# EAGLE design airwatch (EAGLE 9.2.2)
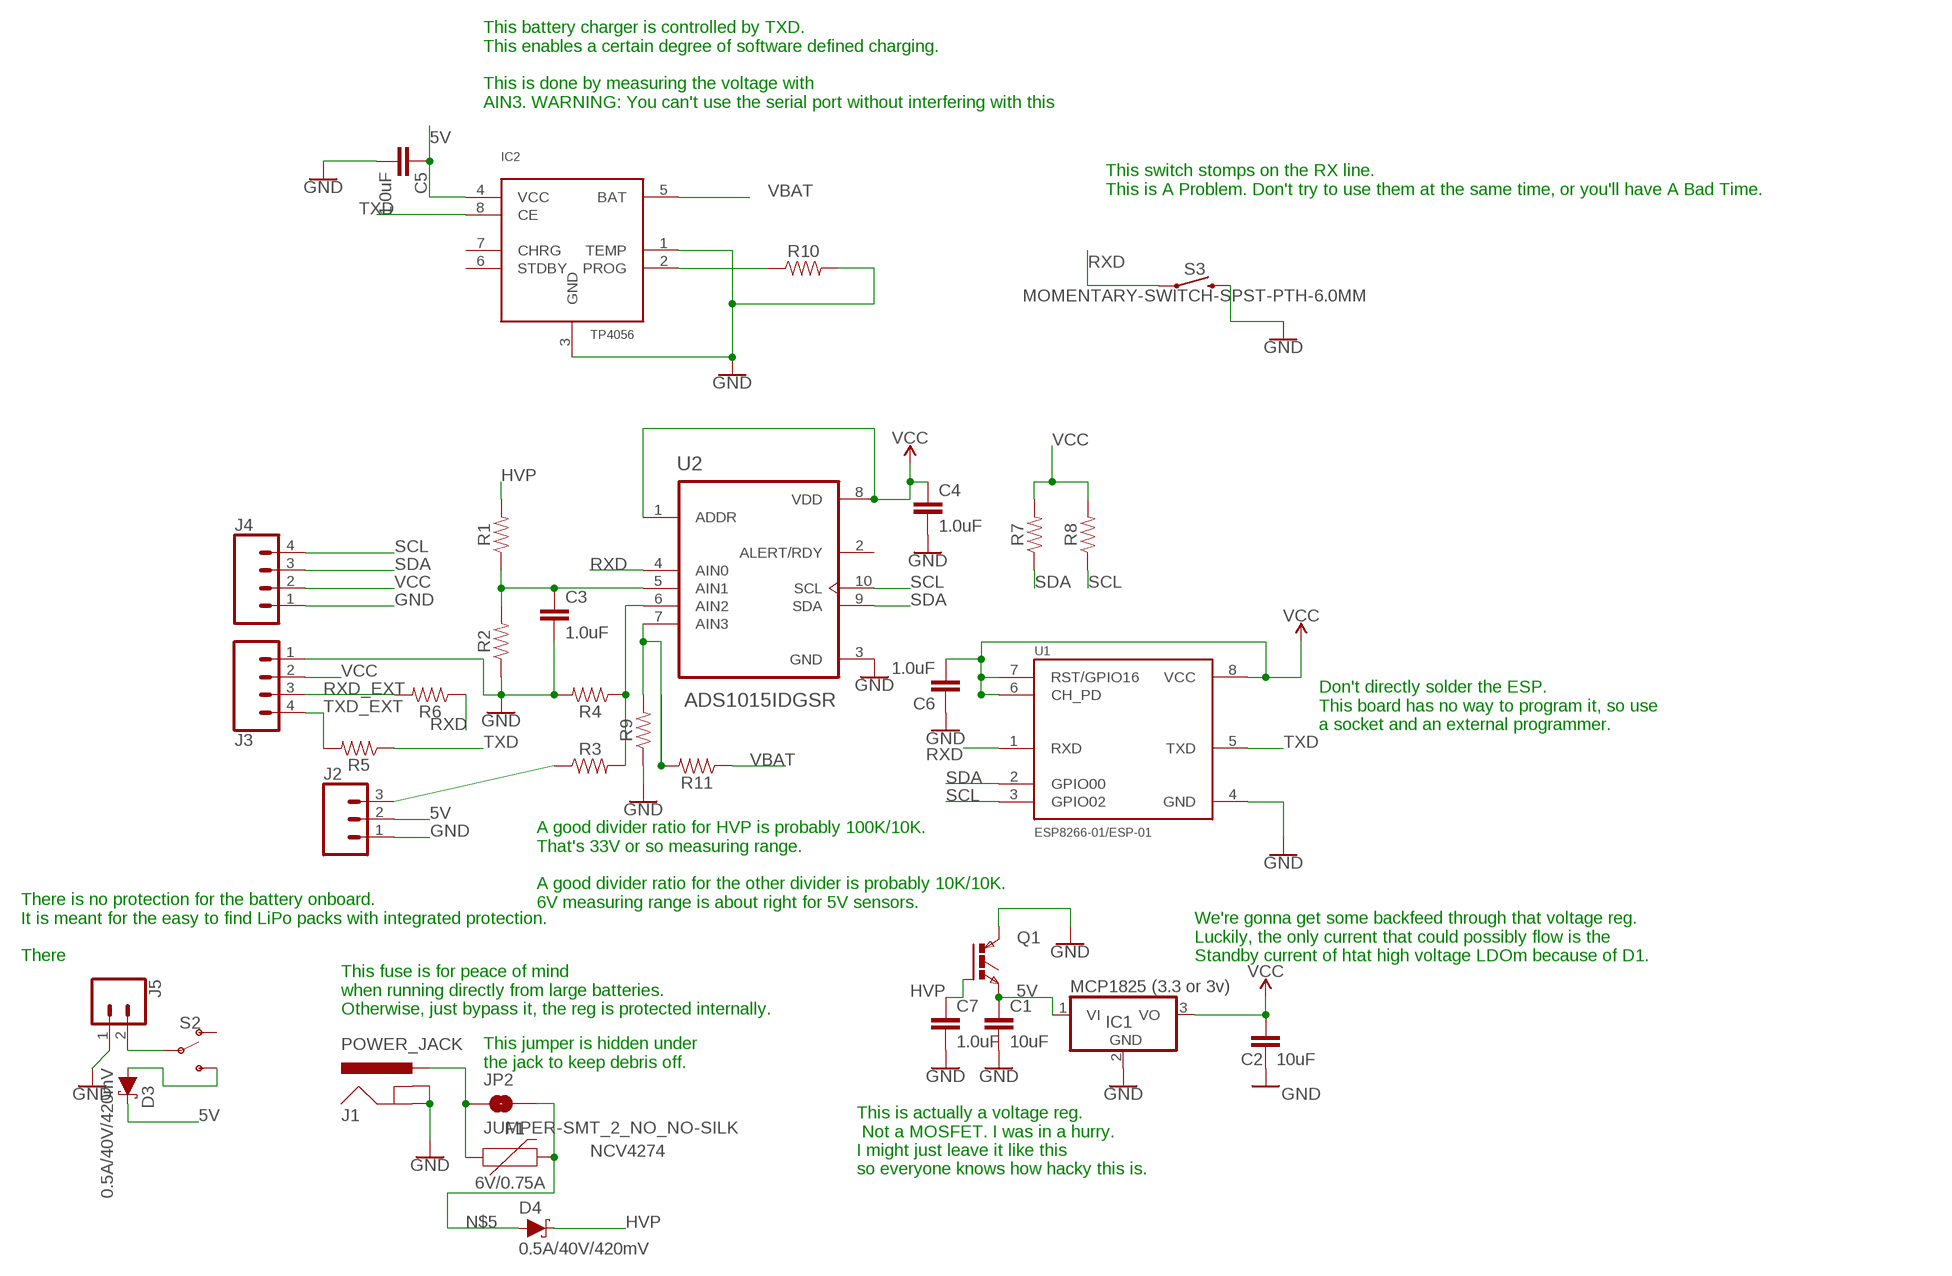
[diagram p0: schematic, sheet 1]

## Parts
C1  10uF  10UF-0805-10V-10%  [0805]
C2  10uF  10UF-0805-10V-10%  [0805]
C3  1.0uF  1.0UF-0805-25V-10%  [0805-EZ]
C4  1.0uF  1.0UF-0805-25V-10%  [0805-EZ]
C5  1.0uF  1.0UF-0805-25V-10%  [0805-EZ]
C6  1.0uF  1.0UF-1206-50V-10%  [1206-EZ]
C7  1.0uF  1.0UF-0805-25V-10%  [0805-EZ]
D3  0.5A/40V/420mV  DIODE-SCHOTTKY-PMEG4005EJ  [SOD-323]
D4  0.5A/40V/420mV  DIODE-SCHOTTKY-PMEG4005EJ  [SOD-323]
F1  6V/0.75A  PPTC_THREE-QUARTER-AMP  [1206]
IC1  MCP1825 (3.3 or 3v)  MCP1703DB  [SOT223]
IC2  TP4056  [SOP-8]
J1  POWER_JACK  [POWER_JACK_PTH]
J2  CONN_03JST-PTH-VERT  [JST-3-PTH-VERT]
J3  CONN_04JST-PTH-VERT  [JST-4-PTH-VERT]
J4  CONN_04JST-PTH-VERT  [JST-4-PTH-VERT]
J5  CONN_02JST-PTH-2  [JST-2-PTH]
JP2  JUMPER-SMT_2_NO_NO-SILK  [SMT-JUMPER_2_NO_NO-SILK]
Q1  NCV4274  IGBTTO252_STM  [TO252_STM]
R1  RESISTOR0805  [0805-EZ]
R2  RESISTOR0805  [0805-EZ]
R3  RESISTOR0805  [0805-EZ]
R4  RESISTOR0805  [0805-EZ]
R5  RESISTOR0805  [0805-EZ]
R6  RESISTOR0805  [0805-EZ]
R7  RESISTOR0805  [0805-EZ]
R8  RESISTOR0805  [0805-EZ]
R9  RESISTOR0805  [0805-EZ]
R10  RESISTOR0805  [0805-EZ]
R11  RESISTOR0805  [0805-EZ]
S2  SWITCH-SPDT-PTH-11.6X4.0MM-LOCK  [SWITCH_SPDT_PTH_11.6X4.0MM_LOCK]
S3  MOMENTARY-SWITCH-SPST-PTH-6.0MM  [TACTILE_SWITCH_PTH_6.0MM]
U1  ESP8266-01/ESP-01  [XCVR_ESP8266-01/ESP-01]
U2  ADS1015IDGSR  [SOP50P490X110-10N]

## Nets
5V: C1.1 C5.1 D3.C IC1.1(VI) IC2.4(VCC) J2.2 Q1.3(E)
GND: C1.2 C2.2 C3.2 C4.2 C5.2 C6.1 C7.2 IC1.2(GND) IC2.1(TEMP) IC2.3(GND) J1.GND J1.GNDBREAK J2.1 J3.1 J4.1 J5.1 Q1.2(C) R2.1 R4.2 R9.1 R10.2 S3.3 U1.4(GND) U2.3(GND)
HVP: C7.1 D4.C Q1.1(G) R1.2
N$1: J2.3 R3.1
N$3: R3.2 R4.1 U2.6(AIN2)
N$4: R9.2 R11.2 U2.7(AIN3)
N$5: D4.A F1.2 JP2.2
N$6: C3.1 R1.1 R2.2 U2.5(AIN1)
N$7 [iso]: F1.1 J1.PWR JP2.1
N$8: J5.2 S2.2(P)
N$11: IC2.2(PROG) R10.1
RXD: R6.1 S3.1 U1.1(RXD) U2.4(AIN0)
RXD_EXT: J3.3 R6.2
SCL: J4.4 R8.1 U1.3(GPIO02) U2.10(SCL)
SDA: J4.3 R7.1 U1.2(GPIO00) U2.9(SDA)
TXD: IC2.8(CE) R5.1 U1.5(TXD)
TXD_EXT: J3.4 R5.2
VBAT: D3.A IC2.5(BAT) R11.1 S2.3(S)
VCC: C2.1 C4.1 C6.2 IC1.3(VO) J3.2 J4.2 R7.2 R8.2 U1.6(CH_PD) U1.7(RST/GPIO16) U1.8(VCC) U2.1(ADDR) U2.8(VDD)
Unconnected: IC2.6(STDBY) IC2.7(CHRG) S2.1(O) U2.2(ALERT/RDY)

## Notes on the sheet
- This battery charger is controlled by TXD.
  This enables a certain degree of software defined charging.
  
  This is done by measuring the voltage with
  AIN3. WARNING: You can't use the serial port without interfering with this
- This switch stomps on the RX line. 
  This is A Problem. Don't try to use them at the same time, or you'll have A Bad Time.
- Don't directly solder the ESP.
  This board has no way to program it, so use
  a socket and an external programmer.
- A good divider ratio for HVP is probably 100K/10K. 
  That's 33V or so measuring range.
  
  A good divider ratio for the other divider is probably 10K/10K. 
  6V measuring range is about right for 5V sensors.
- There is no protection for the battery onboard.
  It is meant for the easy to find LiPo packs with integrated protection.
  
  There
- We're gonna get some backfeed through that voltage reg.
  Luckily, the only current that could possibly flow is the
  Standby current of htat high voltage LDOm because of D1.
- This fuse is for peace of mind
  when running directly from large batteries.
  Otherwise, just bypass it, the reg is protected internally.
- This jumper is hidden under
  the jack to keep debris off.
- This is actually a voltage reg.
   Not a MOSFET. I was in a hurry. 
  I might just leave it like this
  so everyone knows how hacky this is.

## Library data of the parts
C1 C2 = SparkFun-Capacitors:10UF: 10.0µF ceramic capacitors A capacitor is a passive two-terminal electrical component used to store electrical energy temporarily in an electric field.; PROD_ID: CAP-11330
C3-C5 C7 = smd_passives_easy:1.0UF: 1µF ceramic capacitors A capacitor is a passive two-terminal electrical component used to store electrical energy temporarily in an electric field.; PROD_ID: CAP-08064
C6 = smd_passives_easy:1.0UF: 1µF ceramic capacitors A capacitor is a passive two-terminal electrical component used to store electrical energy temporarily in an electric field.; PROD_ID: CAP-09822
D3 D4 = SparkFun-DiscreteSemi:DIODE-SCHOTTKY: Schottky diode A Schottky diode is a semiconductor diode which has a low forward voltage drop and a very fast switching action.; PROD_ID: DIO-10955
F1 = SparkFun-Fuses:PPTC: Resettable Fuse PPTC Resettable Fuse. Really a sort of resistor with a polymeric positive temperature coefficient whose resistance increases dramatically with an increase in temperature. When heated by the power passing through the resistance rises causing the current to be limited, protecting the circuit. This is achieved by the transition of the polymer from a crystalline to an amorphous state where the conductive carbon separates breaking the conductive pathways found in the cool crystalline structure. When a PPTC cools back down it resumes conducting letting the circuit turn back on. SparkFun Products: SparkFun RedBoard - Programmed with Arduino <https://www.sparkfun.com/products/12757> Pro Micro - 5V/16MHz <https://www.sparkfun.com/products/12640> Arduino Pro 328 - 5V/16MHz <https://www.sparkfun.com/products/10915> MP3 Trigger <https://www.sparkfun.com/products/13720>; PROD_ID: RES-11150
IC1 = linear:MCP1703: 250 mA, 16V, Low Quiescent Current LDO Regulator Source: http://ww1.microchip.com/downloads/en/DeviceDoc/22049b.pdf
IC2 = TP4056:TP4056; AVAILABILITY: Unavailable; MF: NanJing Top Power ASIC Corp.; MP: TP4056; PACKAGE: Package Analog Devices; PRICE: None
J1 = SparkFun-Connectors:POWER_JACK: Power Jack Connector This is the standard 5.5mm barrel jack for power. The PTH is the most common, proven, reliable, footprint. The Slot footprint only works if the mill layer is transmitted to the PCB fab house so be warned. Here are the connectors we sell at SparkFun: DC Barrel Power Jack/Connector <https://www.sparkfun.com/products/119> (PRT-00119) DC Barrel Power Jack/Connector (SMD) <https://www.sparkfun.com/products/12748> (PRT-12748) DC Barrel Jack Adapter - Breadboard Compatible <https://www.sparkfun.com/products/10811> (PRT-10811) It is used on this SparkFun product (and many, many others): SparkFun RedBoard - Programmed with Arduino <https://www.sparkfun.com/products/12757> (DEV-12757) Also, if you need a mating power supply or connector, please check these out: Wall Adapter Power Supply - 9VDC 650mA <https://www.sparkfun.com/products/298> (TOL-00298) DC Barrel Jack Adapter - Male <https://www.sparkfun.com/products/10287> (PRT-10287); PROD_ID: CONN-08197
J2 = SparkFun-Connectors:CONN_03: Multi connection point. Often used as Generic Header-pin footprint for 0.1 inch spaced/style header connections On any of the 0.1 inch spaced packages, you can populate with these: Break Away Headers - Straight <https://www.sparkfun.com/products/116> (PRT-00116) Break Away Male Headers - Right Angle <https://www.sparkfun.com/products/553> (PRT-00553) Female Headers <https://www.sparkfun.com/products/115> (PRT-00115) Break Away Headers - Machine Pin <https://www.sparkfun.com/products/117> (PRT-00117) Break Away Female Headers - Swiss Machine Pin <https://www.sparkfun.com/products/743> (PRT-00743) Stackable Header - 3 Pin (Female, 0.1") <https://www.sparkfun.com/products/13875> (PRT-13875) For SCREWTERMINALS and SPRING TERMINALS visit here: Screw Terimnals on SparkFun.com <https://www.sparkfun.com/search/results?term=Screw+Terminals> (5mm/3.5mm/2.54mm spacing) This device is also useful as a general connection point to wire up your design to another part of your project. Our various solder wires solder well into these plated through hole pads. Hook-Up Wire - Assortment (Stranded, 22 AWG) <https://www.sparkfun.com/products/11375> (PRT-11375) Hook-Up Wire - Assortment (Solid Core, 22 AWG) <https://www.sparkfun.com/products/11367> (PRT-11367) View the entire wire category on our website here <https://www.sparkfun.com/categories/141> Special notes: Molex polarized connector foot print use with SKU : PRT-08232 with associated crimp pins and housings.; PROD_ID: CONN-13230
J3 J4 = SparkFun-Connectors:CONN_04: Multi connection point. Often used as Generic Header-pin footprint for 0.1 inch spaced/style header connections On any of the 0.1 inch spaced packages, you can populate with these: Break Away Headers - Straight <https://www.sparkfun.com/products/116> (PRT-00116) Break Away Male Headers - Right Angle <https://www.sparkfun.com/products/553> (PRT-00553) Female Headers <https://www.sparkfun.com/products/115> (PRT-00115) Break Away Headers - Machine Pin <https://www.sparkfun.com/products/117> (PRT-00117) Break Away Female Headers - Swiss Machine Pin <https://www.sparkfun.com/products/743> (PRT-00743) For SCREWTERMINALS and SPRING TERMINALS visit here: Screw Terimnals on SparkFun.com <https://www.sparkfun.com/search/results?term=Screw+Terminals> (5mm/3.5mm/2.54mm spacing) This device is also useful as a general connection point to wire up your design to another part of your project. Our various solder wires solder well into these plated through hole pads. Hook-Up Wire - Assortment (Stranded, 22 AWG) <https://www.sparkfun.com/products/11375> (PRT-11375) Hook-Up Wire - Assortment (Solid Core, 22 AWG) <https://www.sparkfun.com/products/11367> (PRT-11367) View the entire wire category on our website here <https://www.sparkfun.com/categories/141> Special notes: Molex polarized connector foot print use with SKU : PRT-08231 with associated crimp pins and housings. 1MM SMD Version SKU: PRT-10208; PROD_ID: CONN-13251
J5 = SparkFun-Connectors:CONN_02: Multi connection point. Often used as Generic Header-pin footprint for 0.1 inch spaced/style header connections On any of the 0.1 inch spaced packages, you can populate with these: Break Away Headers - Straight <https://www.sparkfun.com/products/116> (PRT-00116) Break Away Male Headers - Right Angle <https://www.sparkfun.com/products/553> (PRT-00553) Female Headers <https://www.sparkfun.com/products/115> (PRT-00115) Break Away Headers - Machine Pin <https://www.sparkfun.com/products/117> (PRT-00117) Break Away Female Headers - Swiss Machine Pin <https://www.sparkfun.com/products/743> (PRT-00743) For SCREWTERMINALS and SPRING TERMINALS visit here: Screw Terimnals on SparkFun.com <https://www.sparkfun.com/search/results?term=Screw+Terminals> (5mm/3.5mm/2.54mm spacing) This device is also useful as a general connection point to wire up your design to another part of your project. Our various solder wires solder well into these plated through hole pads. Hook-Up Wire - Assortment (Stranded, 22 AWG) <https://www.sparkfun.com/products/11375> (PRT-11375) Hook-Up Wire - Assortment (Solid Core, 22 AWG) <https://www.sparkfun.com/products/11367> (PRT-11367) View the entire wire category on our website here <https://www.sparkfun.com/categories/141> Special notes: Molex polarized connector foot print use with: PRT-08233 with associated crimp pins and housings. 2.54_SCREWTERM for use with PRT-10571. 3.5mm Screw Terminal footprints for PRT-08084 5mm Screw Terminal footprints for use with PRT-08432; PROD_ID: CONN-09863; SKU: PRT-09914
JP2 = SparkFun-Jumpers:JUMPER-SMT_2_NO: Normally open jumper This jumper has two pads in close proximity to each other. Apply solder to close the connection. Round pads are easier to solder for beginners, but are a lot larger. SparkFun Product that uses the round pads: SparkFun EL Sequencer <https://www.sparkfun.com/products/12781>
Q1 = IGBT:IGBT: IGBT
R1-R11 = smd_passives_easy:RESISTOR: Generic Resistor Package
S2 = SparkFun-Switches:SWITCH-SPDT: Single Pole, Double Throw (SPDT) Switch Single-pole, double-throw (SPDT) switch. Variant Overview SMD-AYZ0202 Surface Mount DPDT Switch <https://www.sparkfun.com/products/597> (COM-00597) Used on e.g. LilyPad Arduino USB - ATmega32U4 Board <https://www.sparkfun.com/products/12049> PTH-11.6X4.0MM SPDT Mini Power Switch <https://www.sparkfun.com/products/102> (COM-00102) Used on e.g. SparkFun Simon Says - Through-Hole Soldering Kit <https://www.sparkfun.com/products/10547> (KIT-10547) PTH-11.6X4.0MM-KIT KIT version of SPDT Mini Power Switch - Simplifies soldering by removing tStop of switch pins - only one side can be soldered. PTH-11.6X4.0MM-LOCK LOCK version of SPDT Mini Power Switch - Offset pins hold switch in place for easier soldering. SMD-RIGHT-ANGLE Surface Mount Right Angle Switch <https://www.sparkfun.com/products/10860> (COM-10860) Used on e.g. SparkFun ESP8266 Thing <https://www.sparkfun.com/products/13231>; PROD_ID: SWCH-08261; SF_SKU: COM-00102
S3 = SparkFun-Switches:MOMENTARY-SWITCH-SPST: Momentary Switch (Pushbutton) - SPST Normally-open (NO) SPST momentary switches (buttons, pushbuttons). Variants PTH-12MM - 12mm square, through-hole Momentary Pushbutton Switch - 12mm Square <https://www.sparkfun.com/products/9190> (COM-09190) PTH-6.0MM, PTH-6.0MM-KIT - 6.0mm square, through-hole Mini Pushbutton Switch <https://www.sparkfun.com/products/97> (COM-00097) KIT package intended for soldering kit's - only one side of pads' copper is exposed. PTH-RIGHT-ANGLE-KIT - Right-angle, through-hole Right Angle Tactile Button <https://www.sparkfun.com/products/10791> - Used on SparkFun BigTime Watch Kit <https://www.sparkfun.com/products/11734> SMD-12MM - 12mm square, surface-mount Tactile Button - SMD (12mm) <https://www.sparkfun.com/products/12993> (COM-12993) Used on SparkFun PicoBoard <https://www.sparkfun.com/products/11888> SMD-4.5MM - 4.5mm Square Trackball Switch Used on SparkFun Blackberry Trackballer Breakout <https://www.sparkfun.com/products/13169> SMD-4.6MMX2.8MM - 4.60mm x 2.80mm, surface mount Used on SparkFun SAMD21 Mini Breakout <https://www.sparkfun.com/products/13664> SMD-5.2MM, SMD-5.2-REDUNDANT - 5.2mm square, surface-mount Mini Pushbutton Switch - SMD <https://www.sparkfun.com/products/8720> (COM-08720) Used on Arduino Pro Mini <https://www.sparkfun.com/products/11114> REDUNDANT package connects both switch circuits together SMD-6.0X3.5MM - 6.0 x 3.5mm, surface mount Momentary Reset Switch SMD <https://www.sparkfun.com/products/8229> (COM-08229) SMD-6.2MM-TALL - 6.2mm square, surface mount Tactile Button - SMD (6mm) <https://www.sparkfun.com/products/12992> Used on SparkFun Digital Sandbox <https://www.sparkfun.com/products/12651> SMD-RIGHT-ANGLE - Right-angle, surface mount Used on SparkFun Block for Intel® Edison - Arduino <https://www.sparkfun.com/products/13036>; PROD_ID: SWCH-08441; SF_SKU: COM-00097
U1 = ESP8266-01_ESP-01:ESP8266-01/ESP-01: ESP-01 wifi module; AVAILABILITY: Unavailable; MF: AI-Thinker; MP: ESP8266-01/ESP-01; PACKAGE: None; PRICE: None
U2 = ADS1015IDGSR:ADS1015IDGSR: 12-Bit ADC with Integrated MUX, PGA, Comparator, Oscillator, and Reference 10-VSSOP -40 to 125; AVAILABILITY: Unavailable; DESCRIPTION: 12-Bit ADC with Integrated MUX, PGA, Comparator, Oscillator, and Reference 10-VSSOP -40 to 125; MF: Texas Instruments; MP: ADS1015IDGSR; PACKAGE: MSOP-10 Texas Instruments; PRICE: None

## Net classes
1 iso: clearance 0.762 mm

## Board
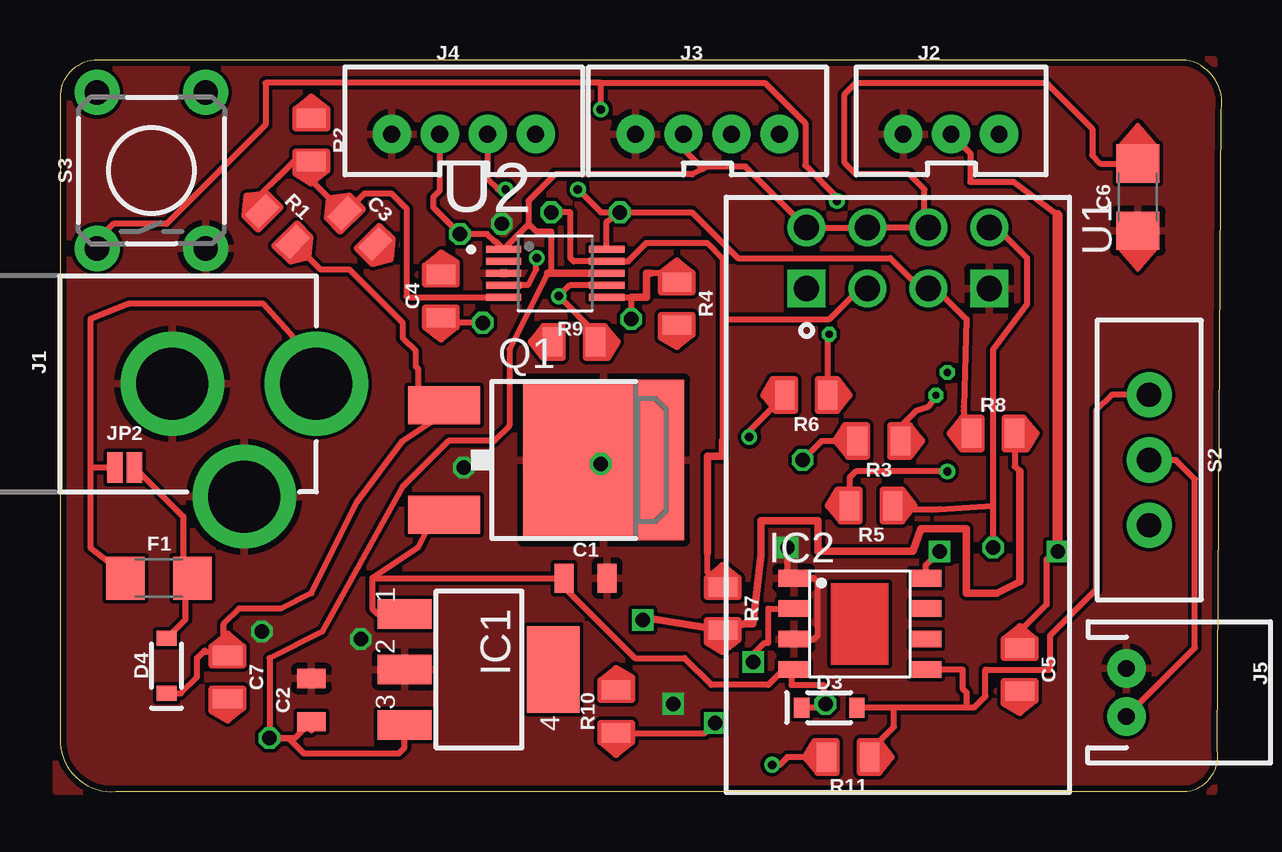
[diagram p1: board, top side]
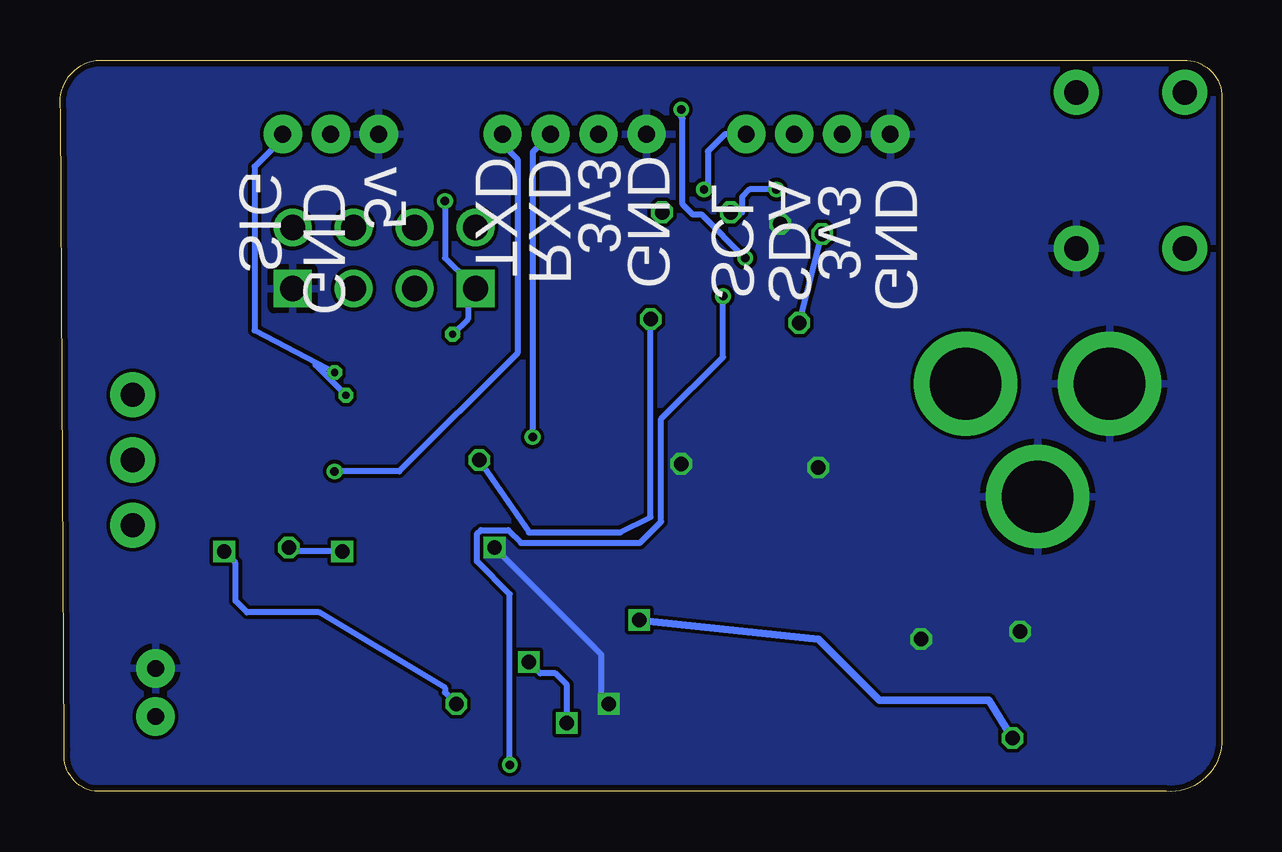
[diagram p2: board, bottom side, seen from below]

Size 48.43 x 30.48 mm. Coordinates in mm from the lower left corner, seen from the top.
Outline: 46.95,30.48 1.73,30.48 arc90 0,29.06 0,2.01 arc90 2.33,0.01 46.98,0.01 arc90 48.25,1.74 48.41,28.39 arc90 46.95,30.48
Copper layers (1*16): Top 0.035mm / dielectric 1.5mm / Bottom 0.035mm
Design rules "SeeedStudio_2layer_DRU_no_angle_20140221 *": minimum track width 8mil, minimum drill 12mil, track to track 6mil, track to pad 6mil, pad to pad 6mil, via to via 6mil, smd to smd 0mil, copper to edge 10mil, drill to drill 10mil, minimum pad ring 10mil, minimum via ring 6mil, stop-mask expansion 2mil, vias tented up to drill 100mil, thermal gap 10mil

### Footprints (pad centres in the part's own frame; a part is rotated, then mirrored left to right if it is on the bottom)
0805 = smd 0.8 x 1.2: 1 -0.9,0; 2 0.9,0
0805-EZ = smd 0.8 x 1.2: 1 -0.9,0; 2 0.9,0
1206-EZ = smd 1.6 x 1.8: 1 -1.4,0; 2 1.4,0
SOD-323 = smd 0.63 x 0.83: A 1.15,0; C -1.15,0
1206 = smd 1.6 x 1.8: 1 -1.4,0; 2 1.4,0
SOT223 = smd 1.219 x 2.235: 1 -2.311,-3.099; 2 0,-3.099; 3 2.311,-3.099 | smd 3.6 x 2.2: 4 0,3.099
SOP-8 = smd 1.3 x 0.7: 1 -2.75,1.905; 2 -2.75,0.635; 3 -2.75,-0.635; 4 -2.75,-1.905; 5 2.75,-1.905; 6 2.75,-0.635; 7 2.75,0.635; 8 2.75,1.905
POWER_JACK_PTH = drill 2.997 pad 4.318: GND 0,7.7; GNDBREAK 4.7,10.7; PWR 0,13.7
JST-3-PTH-VERT = drill 0.7 pad 1.6: 1 -2,-0.55; 2 0,-0.55; 3 2,-0.55
JST-4-PTH-VERT = drill 0.7 pad 1.6: 1 -3,-0.55; 2 -1,-0.55; 3 1,-0.55; 4 3,-0.55
JST-2-PTH = drill 0.7 pad 1.6: 1 -1,0; 2 1,0
SMT-JUMPER_2_NO_NO-SILK = smd 0.635 x 1.27: 1 -0.406,0; 2 0.406,0
TO252_STM = smd 1.6 x 3: 1 -2.28,-4.153; 3 2.28,-4.153 | smd 6.7 x 6.7: 2 0,2.5
SWITCH_SPDT_PTH_11.6X4.0MM_LOCK = drill 1.016 pad 1.88: 1 0,2.718; 2 0,0; 3 0,-2.718
TACTILE_SWITCH_PTH_6.0MM = drill 1.016 pad 1.88: 1 -3.251,2.261; 2 3.251,2.261; 3 -3.251,-2.261; 4 3.251,-2.261
XCVR_ESP8266-01/ESP-01 = drill 1.05 square: 1 0,-3.81; 4 0,3.81 | drill 1.05: 2 0,-1.27; 3 0,1.27; 5 -2.54,3.81; 6 -2.54,1.27; 7 -2.54,-1.27; 8 -2.54,-3.81
SOP50P490X110-10N = smd 1.47 x 0.28: 1 -2.15,1; 2 -2.15,0.5; 3 -2.15,0; 4 -2.15,-0.5; 5 -2.15,-1; 6 2.15,-1; 7 2.15,-0.5; 8 2.15,0; 9 2.15,0.5; 10 2.15,1

### Placement (x,y rotation side)
C1  21.91,8.9 0 top
C2  10.48,3.82 90 top
C3  12.49,23.45 315 top
C4  15.88,20.64 90 top
C5  40.01,5.09 270 top
C6  44.93,24.77 90 top
C7  6.99,4.77 270 top
D3  32.07,3.5 0 top
D4  4.45,5.24 90 top
F1  4.13,8.9 0 top
IC1  17.46,5.09 270 top
IC2  33.34,6.99 0 top
J1  -3.02,16.99 270 top
J2  37.15,27.95 0 top
J3  26.99,27.95 0 top
J4  16.83,27.95 0 top
J5  44.45,4.13 270 top
JP2  2.7,13.5 0 top
Q1  20.16,13.82 270 top
R1  9.07,23.55 315 top
R2  10.48,27.15 270 top
R3  34.13,14.61 180 top
R4  25.72,20.33 270 top
R5  33.81,11.91 180 top
R6  31.11,16.52 180 top
R7  27.62,7.63 270 top
R8  38.89,14.93 0 top
R9  21.43,18.74 0 top
R10  23.18,3.34 90 top
R11  32.86,1.43 180 top
S2  45.4,13.82 180 top
S3  3.81,25.88 90 top
U1  34.93,20.96 270 top
U2  20.64,21.6 0 top

### Tracks (layer width: path | path; a pad name or v marks a point on that pad's centre or on a via)
5V  (via drill 0.6)
  Top 0.254: 13.02,8.9 14.92,10.17 15.56,11.44 Q1.3 | 13.02,8.9 13.02,7.63 13.25,7.4 IC1.1 | 13.02,8.9 20.64,8.9 | 41.59,24.02 39.74,25.41 37.94,25.41 37.94,26.6 J2.2 | 20.64,8.9 23.97,5.56 26.04,5.56 27.15,4.45 29.53,4.45 30.16,5.09 IC2.4 30.48,5.09 30.48,4.45 31.83,4.45 v31.91,3.66 31.75,3.5 D3.C | 20.64,8.9 C1.1 | v41.59,10.01 41.43,10.01 41.12,9.69 41.12,7.78 40.01,6.67 C5.1
  Top 0.406: v41.59,10.01 41.59,24.02
  Bottom 0.254: v31.91,3.66 32.39,4.13 32.39,4.32 37.62,7.47 40.64,7.47 41.12,7.94 41.12,9.53 v41.59,10.01
GND  (via drill 0.6)
  Top 0.254: v30.32,10.17 30.32,8.9 IC2.1 31.43,8.9 31.59,8.74 31.59,6.51 31.43,6.36 IC2.3
  Bottom 0.254: v30.32,10.17 25.88,5.72 25.88,3.97 v25.56,3.66
  other vias: 22.54,13.66 18.41,23.66 12.54,6.36 8.41,6.67 16.83,13.5
  pour Bottom: -0.16,-0.15 -0.16,28.75 arc-90 1.58,30.49 47.79,30.49 arc-90 54.93,23.35 54.93,3.82 arc-90 50.96,-0.15
  pour Top: -0.16,0.01 -0.16,28.59 arc-90 1.74,30.49 48.1,30.49 48.1,0.01
HVP
  Top 0.254: 16.19,15.88 14.29,14.61 12.38,12.07 10.48,8.26 9.21,7.63 7.46,7.63 6.83,6.99 6.83,5.83 | 16.19,15.88 16.22,16.52 Q1.1 | 16.19,15.88 15.08,15.88 14.92,16.04 14.92,17.62 14.83,17.72 14.83,18.36 14.29,18.9 14.29,19.53 12.07,21.75 10.86,21.75 R1.2 | C7.1 6.83,5.83 | 6.83,5.83 6.09,5.83 6.03,5.88 5.71,5.56 5.71,4.77 5.04,4.09 D4.C
N$1  (via drill 0.3)
  Top 0.254: v36.51,16.52 36.19,16.04 35.72,15.88 35.03,15.19 R3.1
  Bottom 0.254: 37.74,17.86 40.32,19.21 40.32,26.04 39.05,27.31 J2.3 | 37.74,17.86 v36.99,17.47 | v36.51,16.52 37.78,17.79 37.74,17.86
N$3  (via drill 0.6)
  Top 0.254: U2.6 23.81,20.6 v23.81,19.69 | R4.1 25.35,21.6 24.45,21.6 | v30.96,13.82 31.75,14.61 R3.2
  Top 0.305: 23.81,20.6 24.45,20.6 24.45,21.6 24.61,21.6
  Bottom 0.254: v30.96,13.82 28.89,10.8 25.08,10.8 23.81,11.44 v23.81,19.69
N$4  (via drill 0.35)
  Top 0.254: v29.69,1.12 30,1.12 30.32,1.43 R11.2 | U2.7 21.25,21.1 v20.8,20.64 22.33,19.11 R9.2
  Bottom 0.254: v29.69,1.12 29.69,8.23 31.05,9.6 31.05,10.73 30.89,10.9 29.75,10.9 29.22,10.36 24.27,10.36 23.37,11.25 23.37,15.53 20.8,18.1 v20.8,20.64
N$5
  Top 0.254: JP2.2 5.14,11.46 5.14,9.28 F1.2 5.24,8.61 5.24,7.19 D4.A
N$6
  Top 0.254: U2.5 14.49,20.6 14.45,20.64 14.45,24.29 13.81,24.93 12.7,24.93 C3.1 10.48,25.47 R2.2 9.74,26.25 9.13,25.64 9.07,25.58 8.43,24.95 R1.1
N$7
  Top 0.254: J1.PWR 10.68,17.87 8.48,20.33 2.86,20.33 1.27,19.69 1.27,13.5 | 1.27,13.5 1.27,10.17 2.73,9.03 F1.1 | JP2.1 1.27,13.5
N$8
  Top 0.254: J5.2 47.31,5.99 47.31,13.02 46.51,13.82 S2.2
N$11  (via drill 0.6)
  Top 0.254: v27.31,2.86 26.91,2.47 26.88,2.44 R10.1 | v28.89,5.4 28.89,5.72 29.37,6.2 29.53,6.2 29.53,7.63 IC2.2
  Bottom 0.254: v27.31,2.86 27.31,4.45 27.78,4.93 28.42,4.93 v28.89,5.4
RXD  (via drill 0.3, 0.35)
  Top 0.254: 22.54,29.53 8.57,29.53 8.57,27.79 4.45,23.66 2.22,23.66 1.55,22.99 S3.1 | 22.54,29.53 29.38,29.53 31.07,27.84 31.07,26.09 32.39,24.77 v32.39,24.61 | U2.4 18.51,21.12 19.53,21.12 19.84,21.75 19.84,22.23 v19.87,22.23 | v22.54,28.42 22.54,29.53 | R6.1 32.02,19 v32.07,19.06
  Bottom 0.254: v32.07,19.06 31.43,19.69 31.43,20.96 | 31.43,20.96 U1.1 | v32.39,24.61 32.39,22.23 31.43,21.28 31.43,20.96 | v19.87,22.23 21.68,24.04 22.05,24.04 22.48,24.47 22.48,28.04 22.54,28.1 v22.54,28.42
RXD_EXT  (via drill 0.35)
  Top 0.254: R6.2 28.73,15.03 v28.73,14.77
  Bottom 0.254: J3.3 28.73,26.65 v28.73,14.77
SCL  (via drill 0.35, 0.6)
  Top 0.254: U2.10 22.79,23.75 v23.34,24.14 | 37.67,16.04 37.78,19.69 36.51,20.96 U1.3 35.88,20.96 34.61,22.23 28.26,22.23 26.35,24.14 v23.34,24.14 | 37.67,16.04 37.67,15.88 | v21.59,25.09 22.54,24.14 v23.34,24.14 | 37.67,16.04 37.67,15.25 R8.1
  Bottom 0.254: J4.4 20.71,27.4 21.43,26.68 21.43,25.09 v21.59,25.09
SDA  (via drill 0.35, 0.6)
  Top 0.254: 27.62,19.69 27.62,22.23 26.99,22.87 24.45,22.87 23.68,22.1 U2.9 21.41,22.1 21.27,22.23 21.27,24.14 v20.48,24.14 | 27.62,19.69 27.62,14.61 | 27.62,19.69 32.07,19.69 33.34,20.96 U1.2 | J4.3 17.83,25.52 18.26,25.09 v18.57,25.09 | R7.1 26.99,9.16 26.99,10.32
  Top 0.305: 26.99,9.95 26.99,10.32 26.99,13.98 27.62,13.98 27.62,14.61
  Bottom 0.254: v20.48,24.14 20,24.14 20,24.77 19.68,25.09 v18.57,25.09
TXD  (via drill 0.6)
  Top 0.254: 36.35,11.75 36.66,11.77 | 36.66,11.77 38.89,11.91 v38.89,10.17 38.89,18.42 40.32,20.33 40.32,22.23 39.05,23.5 U1.5 | IC2.8 36.09,9.42 v36.67,10.01 | R5.1 34.85,11.77 36.66,11.77
  Bottom 0.254: v36.67,10.01 38.58,10.01 v38.89,10.17
TXD_EXT  (via drill 0.35)
  Top 0.254: v36.99,13.34 33.18,13.34 32.91,13.08 R5.2
  Bottom 0.254: J3.4 29.99,26.98 29.37,26.36 29.37,18.26 34.29,13.34 v36.99,13.34
VBAT
  Top 0.254: IC2.5 37.62,5.09 37.62,4.29 37.78,4.13 37.78,3.5 | S2.3 43.83,16.53 43.18,15.88 43.18,8.42 41.28,6.51 41.28,5.09 38.58,5.09 38.58,3.97 38.1,3.5 37.78,3.5 | 37.78,3.5 34.77,3.5 | 34.77,3.5 D3.A | R11.1 33.76,1.7 34.77,2.7 34.77,3.5
VCC  (via drill 0.6)
  Top 0.254: 19.61,23.58 19.53,23.66 19.53,24.61 20.64,25.72 26.35,25.72 26.8,25.95 | 19.61,23.58 19.84,23.34 20.48,23.34 20.48,21.6 | 26.8,25.95 26.99,26.04 28.58,26.04 U1.8 U1.7 U1.6 36.04,23.66 36.04,25.09 35.4,25.72 33.18,25.72 32.7,26.2 32.7,29.06 33.18,29.53 41.12,29.53 43.02,27.63 43.02,26.52 43.37,26.17 C6.2 | 20.32,21.6 18.73,18.42 18.73,15.25 18.1,14.61 16.19,14.61 14.29,12.71 10.93,6.66 8.73,5.56 v8.73,2.23 | 10.48,2.55 C2.1 9.79,2.23 v8.73,2.23 | 19.61,23.58 19.47,23.58 U2.1 18.16,22.93 18.11,22.93 17.81,23.23 v16.67,23.23 15.56,24.34 15.56,24.77 15.83,25.04 J4.2 | 26.8,25.95 25.99,26.75 J3.2 | v8.73,2.23 9.52,2.23 10.16,1.59 14.13,1.59 14.36,1.83 IC1.3 | R8.2 39.79,13.55 40.01,13.34 | v17.62,19.53 16.09,19.53 C4.1
  Top 0.305: 20.32,21.6 20.48,21.6 U2.8 | 40.01,13.34 40.01,8.74 39.05,8.26 37.78,8.26 37.78,10.96 35.88,10.96 35.56,10.01 31.59,10.01 31.59,11.28 29.21,11.28 29.21,9.85 28.89,6.99 28.52,6.99 R7.2 24.66,7.2 v24.29,7.15
  Bottom 0.254: v17.62,19.53 v16.67,23.23
  Bottom 0.305: v24.29,7.15 16.83,6.36 14.29,3.82 9.72,3.82 v8.73,2.23

### Text on the board
_bsilk: 5v | GND | 3v3 | SIG | 3v3 | GND | RXD | TXD | GND | SDA | SCL